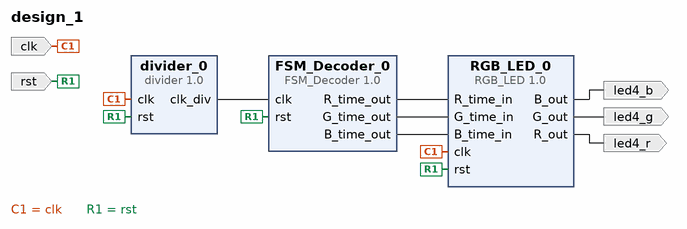
[diagram p0: block diagram of the top level]
# Vivado block design design_1, xc7z020clg400-1, Vivado 2018.3
create_bd_design design_1

create_bd_port -dir I -type clk clk
set_property -dict {CONFIG.FREQ_HZ 125000000} [get_bd_ports clk]
create_bd_port -dir I -type rst rst
set_property -dict {CONFIG.POLARITY ACTIVE_HIGH} [get_bd_ports rst]
create_bd_port -dir O -type data led4_b
create_bd_port -dir O -type data led4_r
create_bd_port -dir O -type data led4_g

create_bd_cell -type ip -vlnv xilinx.com:user:RGB_LED:1.0 RGB_LED_0
create_bd_cell -type ip -vlnv xilinx.com:user:divider:1.0 divider_0
create_bd_cell -type ip -vlnv xilinx.com:user:FSM_Decoder:1.0 FSM_Decoder_0

# ---- connections ----

connect_bd_net [get_bd_ports clk] [get_bd_pins divider_0/clk] [get_bd_pins RGB_LED_0/clk]
connect_bd_net [get_bd_pins divider_0/clk_div] [get_bd_pins FSM_Decoder_0/clk]
connect_bd_net [get_bd_ports rst] [get_bd_pins divider_0/rst] [get_bd_pins RGB_LED_0/rst] [get_bd_pins FSM_Decoder_0/rst]
connect_bd_net [get_bd_pins FSM_Decoder_0/R_time_out] [get_bd_pins RGB_LED_0/R_time_in]
connect_bd_net [get_bd_pins FSM_Decoder_0/G_time_out] [get_bd_pins RGB_LED_0/G_time_in]
connect_bd_net [get_bd_pins FSM_Decoder_0/B_time_out] [get_bd_pins RGB_LED_0/B_time_in]
connect_bd_net [get_bd_pins RGB_LED_0/R_out] [get_bd_ports led4_r]
connect_bd_net [get_bd_pins RGB_LED_0/G_out] [get_bd_ports led4_g]
connect_bd_net [get_bd_pins RGB_LED_0/B_out] [get_bd_ports led4_b]

validate_bd_design
save_bd_design
